# Altium schematic sheet WX0.011.911DL.SchDoc
size A3; Date: 2023/9/20; DocumentNumber: WX0.008.789DL
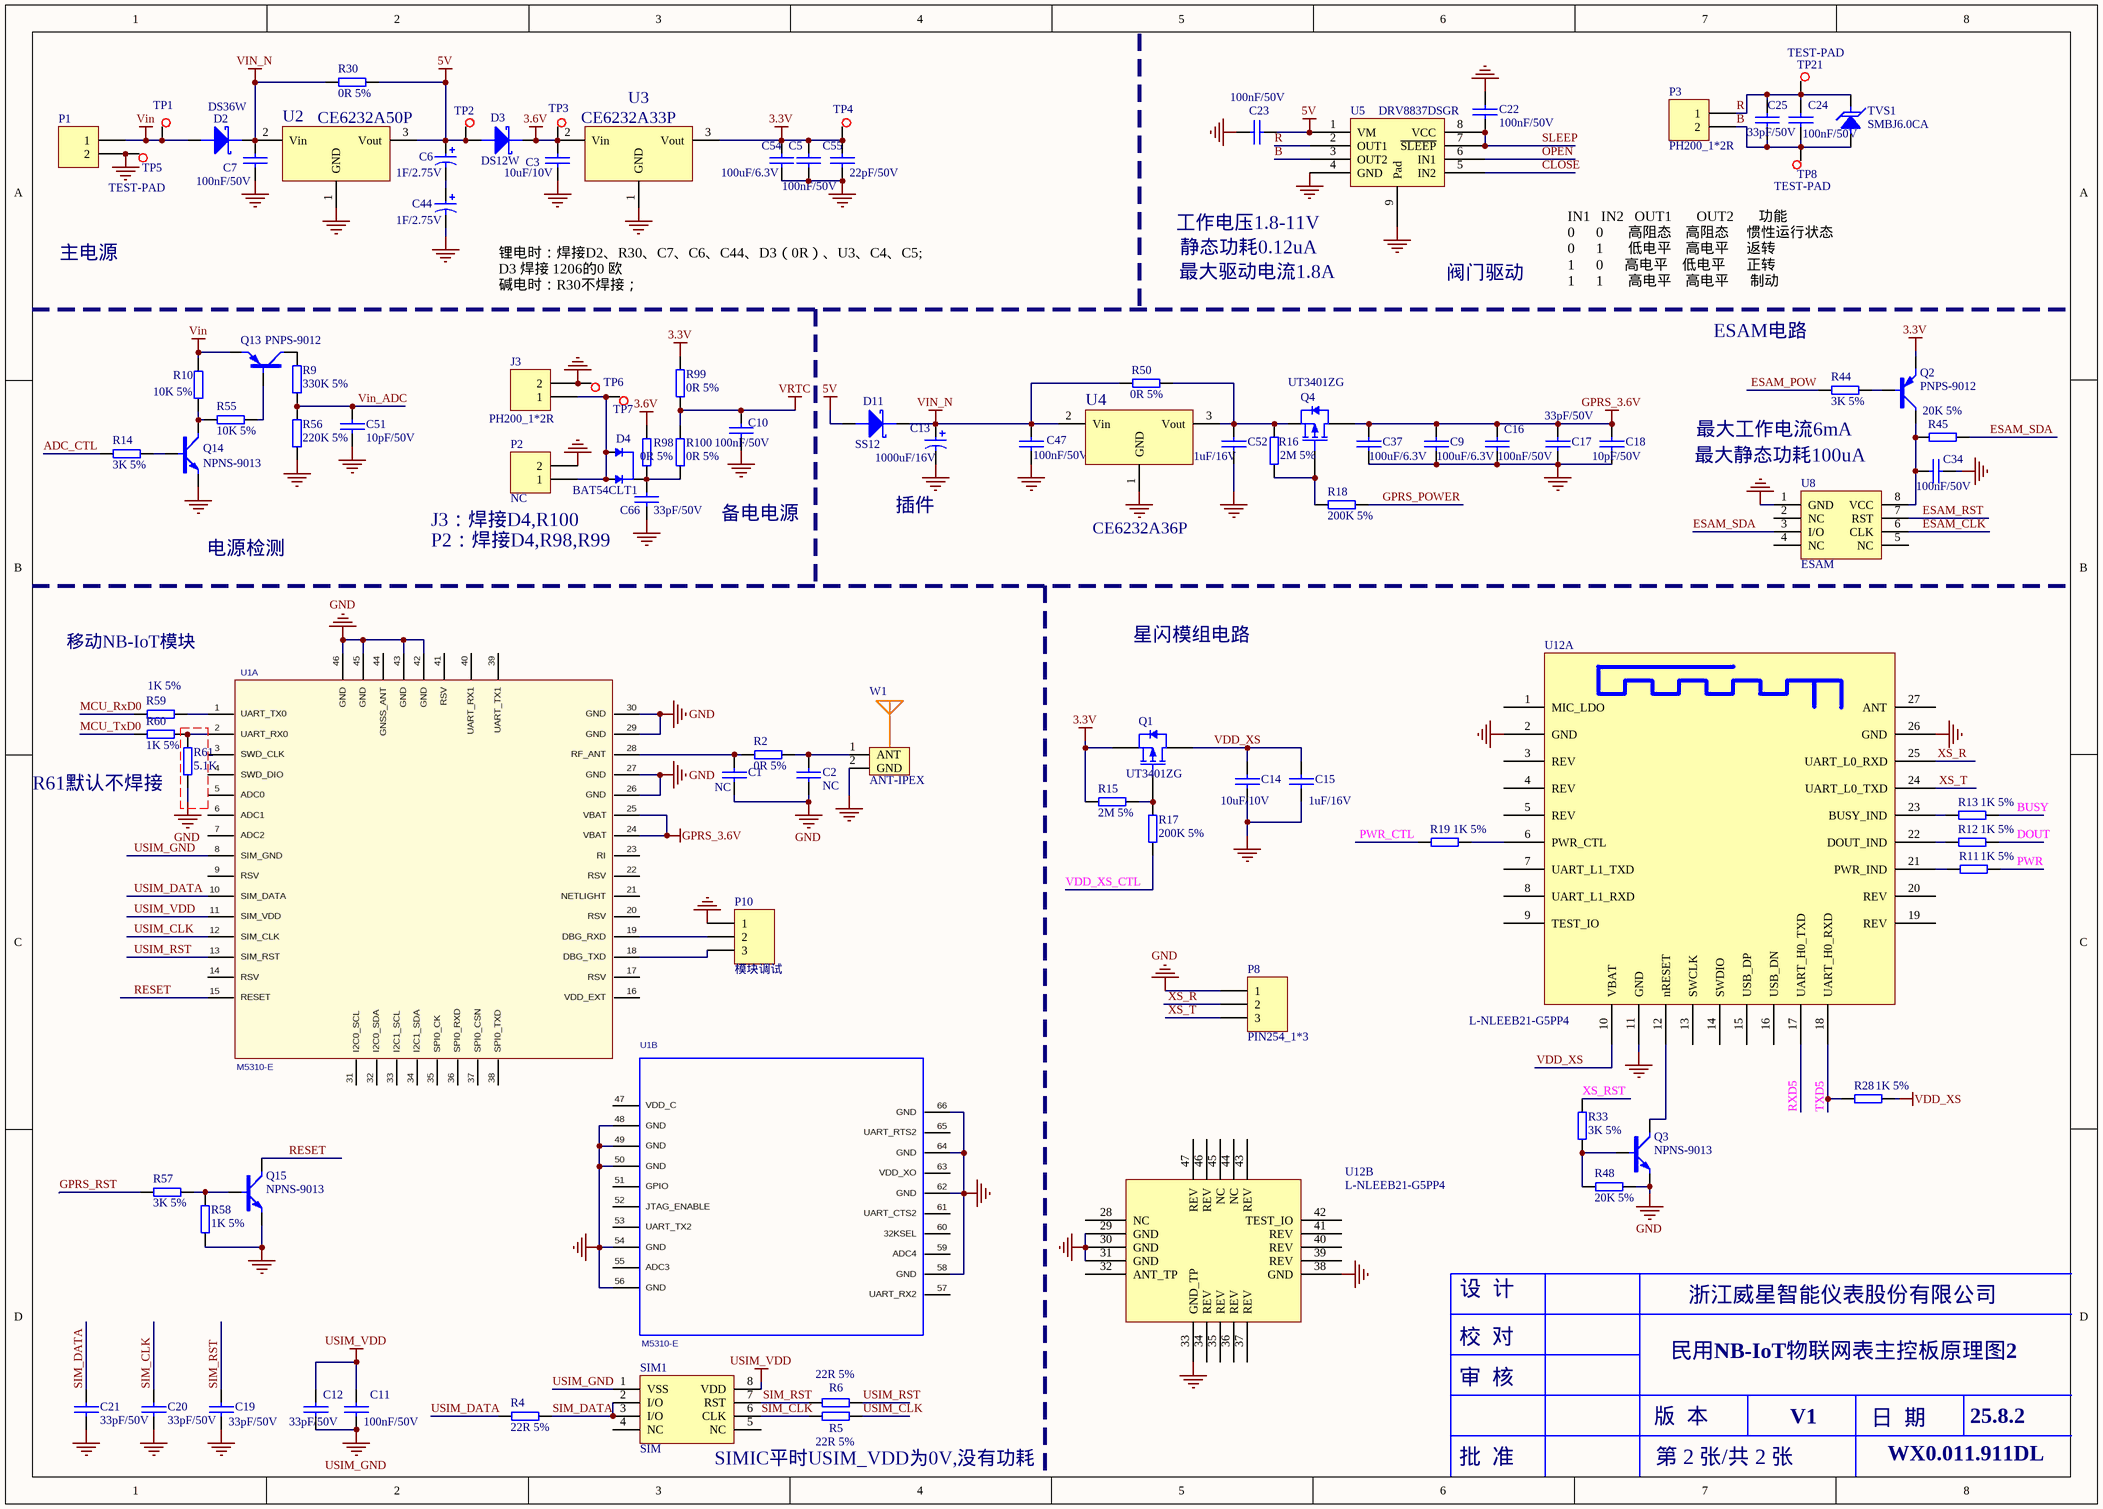
[diagram p0: WX0.011.911DL.SchDoc]

## Parts
C1  NC  [CAP0603]
C2  NC  [CAP0603]
C3  10uF/10V  [CAP0603]
C5  100nF/50V  [CAP0603]
C6  1F/2.75V  [CAPPC_350_800_1600R]
C7  100nF/50V  [CAP0603]
C9  100uF/6.3V  [GRM1206]
C10  100nF/50V  [CAP0603]
C11  100nF/50V  [CAP0603]
C12  33pF/50V  [CAP0603]
C13  1000uF/16V  [CAPPC_500_800_2000R]
C14  10uF/10V  [CAP0603]
C15  1uF/16V  [CAP0603]
C16  100nF/50V  [CAP0603]
C17  33pF/50V  [CAP0603]
C18  10pF/50V  [CAP0603]
C19  33pF/50V  [CAP0603]
C20  33pF/50V  [CAP0603]
C21  33pF/50V  [CAP0603]
C22  100nF/50V  [CAP0603]
C23  100nF/50V  [CAP0603]
C24  100nF/50V  [CAP0603]
C25  33pF/50V  [CAP0603]
C34  100nF/50V  [CAP0603]
C37  100uF/6.3V  [GRM1206]
C44  1F/2.75V  [CAPPC_350_800_1600R]
C47  100nF/50V  [CAP0603]
C51  10pF/50V  [CAP0603]
C52  1uF/16V  [CAP0603]
C54  100uF/6.3V  [GRM1206]
C55  22pF/50V  [CAP0603]
C66  33pF/50V  [CAP0603]
D2  DS36W  [SOD-123FL]
D3  DS12W  [SOD-123FL]
D4  BAT54CLT1  [SOT-23]
D11  SS12  [DO-214AC]
J3  PH200_1*2R
P1  (no value)  [PH200_1*2R_BAT]
P2  NC  [PH200_1*2R_BAT]
P3  PH200_1*2R  [PH200_1*2R]
P8  PIN254_1*3  [PIN254_1*3*WXHJ]
P10  模块调试  [PIN254_1*3*WXHJ]
Q1  UT3401ZG  [SOT-23]
Q2  PNPS-9012  [SOT-23]
Q3  NPNS-9013  [SOT-23]
Q4  UT3401ZG  [SOT-23]
Q13  PNPS-9012  [SOT-23]
Q14  NPNS-9013  [SOT-23]
Q15  NPNS-9013  [SOT-23]
R2  0R 5%  [RES0603]
R4  22R 5%  [RES0603]
R5  22R 5%  [RES0603]
R6  22R 5%  [RES0603]
R9  330K 5%  [RES0603]
R10  10K 5%  [RES0603]
R11  1K 5%  [RES0603]
R12  1K 5%  [RES0603]
R13  1K 5%  [RES0603]
R14  3K 5%  [RES0603]
R15  2M 5%  [RES0603]
R16  2M 5%  [RES0603]
R17  200K 5%  [RES0603]
R18  200K 5%  [RES0603]
R19  1K 5%  [RES0603]
R28  1K 5%  [RES0603]
R30  0R 5%  [RES1206]
R33  3K 5%  [RES0603]
R44  3K 5%  [RES0603]
R45  20K 5%  [RES0603]
R48  20K 5%  [RES0603]
R50  0R 5%  [RES1206]
R55  10K 5%  [RES0603]
R56  220K 5%  [RES0603]
R57  3K 5%  [RES0603]
R58  1K 5%  [RES0603]
R59  1K 5%  [RES0603]
R60  1K 5%  [RES0603]
R61  5.1K  [RES0603]
R98  0R 5%  [RES0603]
R99  0R 5%  [RES0603]
R100  0R 5%  [RES0603]
SIM1  SIM  [SIMIC]
TP1  TEST-PAD  [TEST-PAD]  (value not drawn)
TP2  TEST-PAD  [TEST-PAD]  (value not drawn)
TP3  TEST-PAD  [TEST-PAD]  (value not drawn)
TP4  TEST-PAD  [TEST-PAD]  (value not drawn)
TP5  TEST-PAD  [TEST-PAD]
TP6  TEST-PAD  [TEST-PAD]  (value not drawn)
TP7  TEST-PAD  [TEST-PAD]  (value not drawn)
TP8  TEST-PAD  [TEST-PAD]
TP21  TEST-PAD  [TEST-PAD]
TVS1  SMBJ6.0CA  [DO-214AA]
U1  M5310-E  [MOD_M5310EV]  (parts A,B of 2)
U2  CE6232A50P  [SOT-89]
U3  CE6232A33P  [SOT-89]
U4  CE6232A36P  [SOT-89]
U5  DRV8837DSGR  [S-PWSON-N8]
U8  ESAM
U12  L-NLEEB21-G5PP4  [L-NLEEB21-G5BP4]  (parts A,B of 2)
W1  ANT-IPEX  [ANT-IPEX]

## Nets
3.3V: C5.1 C54.2 C55.1 Q1.2(S) Q2.2(E) R15.1 R99.2 TP4.1 U3.3(Vout)
3.6V: C3.1 D3.2 R98.2 TP3.1 U3.2(Vin)
5V: C6.1 C23.2 D3.1 D11.1 R30.2 TP2.1 U2.3(Vout) U5.1(VM)
GND: C1.1 C2.1 C3.2 C5.2 C7.2 C9.2 C10.2 C13.2 C14.2 C15.2 C16.2 C17.2 C18.1 C19.2 C20.2 C21.2 C22.1 C23.1 C34.2 C37.2 C44.2 C47.2 C51.1 C52.2 C54.1 C55.2 C66.2 J3.2 P1.2 P2.2 P8.1 P10.1 Q3.2(E) Q14.2(E) Q15.2(E) R48.2 R56.2 R58.1 R61.2 TP5.1 TP6.1 U1.26(GND) U1.27(GND) U1.29(GND) U1.30(GND) U1.42(GND) U1.43(GND) U1.45(GND) U1.46(GND) U1.48(GND) U1.49(GND) U1.50(GND) U1.54(GND) U1.56(GND) U1.58(GND) U1.62(GND) U1.64(GND) U1.66(GND) U2.1(GND) U3.1(GND) U4.1(GND) U5.4(GND) U5.9(Pad) U8.1(GND) U12.2(GND) U12.11(GND) U12.26(GND) U12.29(GND) U12.30(GND) U12.31(GND) U12.33(GND_TP) U12.38(GND) W1.2(GND)
GPRS_3.6V: C9.1 C16.1 C17.1 C18.2 C37.1 Q4.3(D) U1.24(VBAT) U1.25(VBAT)
USIM_GND: C11.2 C12.2 SIM1.1(VSS) U1.8(SIM_GND)
USIM_VDD: C11.1 C12.1 SIM1.8(VDD) U1.11(SIM_VDD)
VDD_XS: C14.1 C15.1 Q1.3(D) R28.1 U12.10(VBAT)
Vin: D2.1 P1.1 Q13.2(E) R10.2 TP1.1
VIN_N: C7.1 C13.1 C47.1 D2.2 D11.2 R30.1 R50.1 U2.2(Vin) U4.2(Vin)
VRTC: C10.1 R99.1 R100.2
ADC_CTL: R14.1
B: C24.2 C25.2 P3.2 TP8.1 TVS1.1 U5.3(OUT2)
BUSY: R13.1
CLOSE: U5.5(IN2)
DOUT: R12.1
ESAM_CLK: U8.6(CLK)
ESAM_POW: R44.1
ESAM_RST: U8.7(RST)
ESAM_SDA: R45.2 U8.3(I/O)
GPRS_POWER: R18.1
GPRS_RST: R57.1
MCU_RxD0: R59.1
MCU_TxD0: R60.1
OPEN: U5.6(IN1)
PWR: R11.1
PWR_CTL: R19.2
R: C24.1 C25.1 P3.1 TP21.1 TVS1.2 U5.2(OUT1)
RESET: Q15.3(C) U1.15(RESET)
RXD5: U12.17(UART_H0_TXD)
SIM_CLK: C20.1 R5.1 SIM1.6(CLK)
SIM_DATA: C21.1 R4.2 SIM1.2(I/O) SIM1.3(I/O)
SIM_RST: C19.1 R6.1 SIM1.7(RST)
SLEEP: C22.2 U5.7(~{SLEEP}) U5.8(VCC)
TXD5: R28.2 U12.18(UART_H0_RXD)
USIM_CLK: R5.2 U1.12(SIM_CLK)
USIM_DATA: R4.1 U1.10(SIM_DATA)
USIM_RST: R6.2 U1.13(SIM_RST)
VDD_XS_CTL: R17.1
Vin_ADC: C51.2 R9.2 R56.1
XS_R: P8.2 U12.25(UART_L0_RXD)
XS_RST: R33.1
XS_T: P8.3 U12.24(UART_L0_TXD)
NetC1_2: C1.2 R2.2 U1.28(RF_ANT)
NetC2_2: C2.2 R2.1 W1.1(ANT)
NetC6_2: C6.2 C44.1
NetC34_1: C34.1 Q2.3(C) R45.1 U8.8(VCC)
NetC52_1: C52.1 Q4.2(S) R16.2 R50.2 U4.3(Vout)
NetC66_1: C66.1 D4.3(C) R98.1 R100.1
NetD4_1: D4.1(A) D4.2(A) J3.1 P2.1 TP7.1
NetP10_2: P10.2 U1.19(DBG_RXD)
NetP10_3: P10.3 U1.18(DBG_TXD)
NetQ1_1: Q1.1(G) R15.2 R17.2
NetQ2_1: Q2.1(B) R44.2
NetQ3_1: Q3.1(B) R33.2 R48.1
NetQ3_3: Q3.3(C) U12.12(nRESET)
NetQ4_1: Q4.1(G) R16.1 R18.2
NetQ13_1: Q13.1(B) R55.2
NetQ13_3: Q13.3(C) R9.1
NetQ14_1: Q14.1(B) R14.2
NetQ14_3: Q14.3(C) R10.1 R55.1
NetQ15_1: Q15.1(B) R57.2 R58.2
NetR11_2: R11.2 U12.21(PWR_IND)
NetR12_2: R12.2 U12.22(DOUT_IND)
NetR13_2: R13.2 U12.23(BUSY_IND)
NetR19_1: R19.1 U12.6(PWR_CTL)
NetR59_2: R59.2 U1.1(UART_TX0)
NetR60_2: R60.2 R61.1 U1.2(UART_RX0)

Not connected (* = marked no-connect by the designer): SIM1 4(NC) 5(NC); U1 3(SWD_CLK) 4(SWD_DIO) 5(ADC0) 6(ADC1) 7(ADC2) 9(RSV) 14(RSV) 16(VDD_EXT) 17(RSV) 20(RSV) 21(NETLIGHT) 22(RSV) 23(RI) 31(I2C0_SCL) 32(I2C0_SDA) 33(I2C1_SCL) 34(I2C1_SDA) 35(SPI0_CK) 36(SPI0_RXD) 37(SPI0_CSN) 38(SPI0_TXD) 39(UART_TX1) 40(UART_RX1) 41(RSV) 44(GNSS_ANT) 47(VDD_C) 51(GPIO) 52(JTAG_ENABLE) 53(UART_TX2) 55(ADC3) 57(UART_RX2) 59(ADC4) 60(32KSEL) 61(UART_CTS2) 63(VDD_XO) 65(UART_RTS2); U8 2(NC) 4(NC) 5(NC); U12 1(MIC_LDO) 3(REV) 4(REV) 5(REV) 7(UART_L1_TXD) 8(UART_L1_RXD) 9(TEST_IO) 13(SWCLK) 14(SWDIO) 15(USB_DP) 16(USB_DN) 19(REV) 20(REV) 27(ANT) 28(NC) 32(ANT_TP) 34(REV) 35(REV) 36(REV) 37(REV) 39(REV) 40(REV) 41(REV) 42(TEST_IO) 43(REV) 44(NC) 45(NC) 46(REV) 47(REV)

## Notes on the sheet
- 工作电压1.8-11V
- 主电源
- 锂电时：焊接D2、R30、C7、C6、C44、D3（0R）、U3、C4、C5; D3 焊接 1206的0 欧
  碱电时：R30不焊接；
- 最大驱动电流1.8A
- 静态功耗0.12uA
- 阀门驱动
- IN1   IN2   OUT1       OUT2       功能
  0      0       高阻态    高阻态     惯性运行状态
  0      1       低电平    高电平     返转
  1      0      高电平    低电平      正转
  1      1       高电平    高电平      制动
- ESAM电路
- 最大工作电流6mA
- 插件
- (near U8) 最大静态功耗100uA
- 电源检测
- P2：焊接D4,R98,R99
- (near P2) J3：焊接D4,R100
- 备电电源
- 移动NB-IoT模块
- 星闪模组电路
- R61默认不焊接
- 设  计
- 浙江威星智能仪表股份有限公司
- 审  核
- 校  对
- 民用NB-IoT物联网表主控板原理图2
- 版  本
- V1
- 日  期
- WX0.011.911DL
- 25.8.2
- SIMIC平时USIM_VDD为0V,没有功耗
- 批  准
- 第 2 张/共 2 张
- 设   计
- 校   对
- 邓琴琴
- 冯翰
- 审   核
- 标准化
- 版本
- 日期
- 批   准
- 刘晓峰
- 第       张  /  共       张

## Library data of the parts
C1 C2 = 101020103-0005: 12P,50 V,±5%,0603,国巨,CC0603JRNPO9BN12; Part Name: 0603贴片电容; ID: 11; SMD/DIP: SMD; Part Number: 101020103-0005
C3 C14 = 101020103-0026: 106pF,10 V,±10%,0603,村田,GRM188R61A106KE47D; Part Name: 0603贴片电容; ID: 8; SMD/DIP: SMD; Part Number: 101020103-0026
C5 C7 C10 C11 C16 C22-C24 C34 C47 = 101020103-0021: 104pF,50 V,±10%,0603,国巨,CC0603KRX7R9BB104; Part Name: 0603贴片电容; ID: 3; SMD/DIP: SMD; Part Number: 101020103-0021
C6 C44 = 1010202-0015: 1F,2.75 V,-20%~+20%,8mm*16mm,红宝石,2.7 DMC 1 M MY4 8X16; Part Name: 法拉电容; ID: 12; SMD/DIP: DIP; Part Number: 1010202-0015
C9 C37 C54 = 101020101-0020: 100uF,6.3 V,±20%,1206,村田,GRM31CR60J107ME39L; Part Name: 贴片电容; ID: 27; SMD/DIP: SMD; Part Number: 101020101-0020
C12 C17 C19-C21 C25 C66 = 101020103-0027: 33pF,50 V,±10%,0603,国巨,CC0603KRNPO9BN33; Part Name: 0603贴片电容; ID: 18; SMD/DIP: SMD; Part Number: 101020103-0027
C13 = 1010203-0029: 1000uF,16 V,±20%,8*20mm,Rubycon,16ZLH1000M; Part Name: 电解电容; ID: 2; SMD/DIP: DIP; Part Number: 1010203-0029
C15 C52 = 101020103-0003: 105pF,16 V,±10%,0603,国巨,CC0603KRX7R7BB105; Part Name: 0603贴片电容; ID: 14; SMD/DIP: SMD; Part Number: 101020103-0003
C18 C51 = 101020103-0014: 10pF,50 V,±5%,0603,X7R,国巨,CC0603JRNPO9BN100; Part Name: 0603贴片电容; ID: 7; SMD/DIP: SMD; Part Number: 101020103-0014
C55 = 101020103-0009: 22pF,50 V,±5%,0603,国巨,CC0603JRNPO9BN22; Part Name: 0603贴片电容; ID: 16; SMD/DIP: SMD; Part Number: 101020103-0009
D2 = 101040101-0048: DS36W,SOD123-FL,3 A,42 V,60 V,浙江领晨科技有限公司,DS36W; Part Number: 101040101-0055; Part Name: 贴片肖特基; ID: 8; SMD/DIP: SMD
D3 = 101040101-0048: DS12W,SOD-123FL,1 A,0.55 V,20 V,领晨科技,DS12W; Part Name: 贴片肖特基; ID: 9; SMD/DIP: SMD; Part Number: 101040101-0048
D4 = 101040101-0038: BAT54CLT1，SOT23-3,SOT23-3,0.2 A,0.8 V,30 V,安森美,BAT54CLT1; Part Name: 贴片肖特基; ID: 31; SMD/DIP: SMD; Part Number: 101040101-0038
D11 = 101040101-0009: SS12,DO-214AC,1 A,0.55 V,20 V,昶鑫,SS12; Part Name: 贴片肖特基; ID: 13; SMD/DIP: SMD; Part Number: 101040101-0009
J3 P1-P3 = 1010902-0105: 2.0-2AW,直插弯座，2PIN，脚间距2mm，带防翘起,公头,单排,2.0-2AW;直插弯座，2PIN,脚间距2mm，带防翘起; Part Name: PH座; ID: 11; SMD/DIP: DIP; Part Number: 1010902-0105
P10 = AD_WXHJ_PinHeader_04: 1*3 ，Φ1.0 ，2.54mm，直脚,无需焊接器件; Part Name: 排针; ID: 27; SMD/DIP: DIP; Part Number: AD_WXHJ_PinHeader_04
Q1 Q4 = 101040201-0013: UT3401ZG,P-MOS,SOT-23,UTC,UT3401ZG; Part Name: 功率MOS管; ID: 18; SMD/DIP: SMD; Part Number: 101040201-0013
Q2 = 101040201-0001: 9012,PNP,SOT-23,JCET;长电,S9012; Part Name: 贴片三极管; ID: 16; SMD/DIP: SMD; Part Number: 101040201-0001
Q3 Q14 = 101040201-0002: 9013,NPN,SOT-23,长电,S9013; Part Name: 贴片三极管; ID: 15; SMD/DIP: SMD; Part Number: 101040201-0002
Q13 = 101040201-0001: 9012,PNP,SOT-23,JCET;长电,S9012; Part Name: 贴片三极管; ID: 17; SMD/DIP: SMD; Part Number: 101040201-0001
Q15 = 101040201-0002: 9013,NPN,SOT-23,长电,S9013; Part Name: 贴片三极管; ID: 14; SMD/DIP: SMD; Part Number: 101040201-0002
R2 = 101010103-0001: 国巨,±5%,0603,,155 ℃,-55 ℃,RC0603J2-070RL,无铅,200 ppm/℃,1/10W,,0R; Part Name: 0603贴片电阻; ID: 1; SMD/DIP: SMD; Part Number: 101010103-0001
R4-R6 = 101010103-0009: 国巨,±5%,0603,,155 ℃,-55 ℃,RC0603JR-0722RL,无铅,200 ppm/℃,1/10W,,22欧; Part Name: 0603贴片电阻; ID: 17; SMD/DIP: SMD; Part Number: 101010103-0009
R9 = 101010103-0066: 330K,±5%,1/10W,0603,国巨,RC0603JR-07330KL; Part Name: 0603贴片电阻; ID: 31; SMD/DIP: SMD; Part Number: 101010103-0066
R10 R44 R55 = 101010103-0003: 国巨,±5%,0603,,155 ℃,-55 ℃,RC0603JR-0710KL,无铅,200 ppm/℃,1/10W,,10K; Part Name: 0603贴片电阻; ID: 7; SMD/DIP: SMD; Part Number: 101010103-0003
R11-R13 R19 R28 R58 = 101010103-0008: 1K,±5%,1/10W,0603,国巨,RC0603JR-071KL; Part Name: 0603贴片电阻; ID: 10; SMD/DIP: SMD; Part Number: 101010103-0008
R14 R33 = 101010103-0006: 国巨,±5%,0603,,155 ℃,-55 ℃,RC0603JR-073KL,无铅,100 ppm/℃,1/10W,,3K; Part Name: 0603贴片电阻; ID: 23; SMD/DIP: SMD; Part Number: 101010103-0006
R15 R17 = 101010103-0003: 10K±5%,1/10W,0603; Part Name: 0603贴片电阻; ID: 32; Part Number: 101010103-0003
R16 = 101010103-0025: 国巨,±5%,0603,,155 ℃,-55 ℃,RC0603JR-072ML,含铅,100 ppm/℃,1/10W,,2M; Part Name: 0603贴片电阻; ID: 20; SMD/DIP: SMD; Part Number: 101010103-0025
R18 = 101010103-0034: 200K,±5%,1/10W,0603,国巨,RC0603JR-07200KL; Part Name: 0603贴片电阻; ID: 13; SMD/DIP: SMD; Part Number: 101010103-0034
R30 R50 R98-R100 = 101010101-0013: 0Ω,±5%,1/4W,1206,国巨,RC1206JR-070RL; Part Name: 1206贴片电阻; ID: 2; SMD/DIP: SMD; Part Number: 101010101-0013
R45 R48 R60 R61 = 101010103-0004: 国巨,±5%,0603,,155 ℃,-55 ℃,RC0603JR-0720KL,无铅,200 ppm/℃,1/10W,,20K; Part Name: 0603贴片电阻; ID: 15; SMD/DIP: SMD; Part Number: 101010103-0004
R56 = 101010103-0044: 220K,±5%,1/10W,0603,国巨,RC0603JR-07220KL; Part Name: 0603贴片电阻; ID: 30; SMD/DIP: SMD; Part Number: 101010103-0044
R57 = 101010103-0006: 国巨,±5%,0603,,155 ℃,-55 ℃,RC0603JR-073KL,无铅,100 ppm/℃,1/10W,,3K; Part Name: 0603贴片电阻; ID: 22; SMD/DIP: SMD; Part Number: 101010103-0006
R59 = 101010103-0008: 1K,±5%,1/10W,0603,国巨,RC0603JR-071KL; Part Name: 0603贴片电阻; ID: 9; SMD/DIP: SMD; Part Number: 101010103-0008
SIM1 = 05_SIMIC
TP1-TP8 TP21 = AD_WXHJ_TEST-PAD_01: 单面焊盘测试点; Part Name: 测试点; ID: 23; SMD/DIP: SMD; Part Number: AD_WXHJ_TEST-PAD_01
TVS1 = 101040101-0024: SMBJ6.0CA,DO-214AA,10.3 V,6.0 V,600 W,58.3 A,800 uA,上海君耀电子有限公司,SMBJ6.0CA; Part Name: TVS管; ID: 23; SMD/DIP: SMD; Part Number: 101040101-0024
U1 = MOD_M5310EV_LGA66P: Module_M5310EV_0.9mm; Vendor: 中移物联网; Geometry.Height: 0.9mm; Value: Module_M5310EV; Manufacturer: Module_M5310EV; PCB DECAL: MOD_M5310EV
U2 = 1010503-0013: S-1206B50-U3,S-1206B50-U3,SOT89-3,6.5 V,1.7 V,0.2 V,5 V,250mA@VIN≧VOUT(S)＋1.0 V﹐1.5 V≦VOUT(S),1 uA,精工电子; Part Name: 贴片稳压器; ID: 6; SMD/DIP: SMD; Part Number: 1010503-0013
U3 = 1010503-0002: S-1206B33-U3T1G,S-1206B33-U3T1G,SOT89-3,6.5 V,1.7 V,0.15 V,3.3 V,250mA@VIN≧VOUT(S)＋1.0 V﹐1.5 V≦VOUT(S),1 uA,精工电子; Part Name: 线性稳压芯片; ID: 5; SMD/DIP: SMD; Part Number: 1010503-0002
U4 = 1010503-0031: CE6232A36P,CE6232A36P,SOT89-3,8 V,1.8 V,0.11 V,3.6 V,600mA,0.8 uA,南京芯力微电子有限公司; Part Name: 贴片稳压器; ID: 30; SMD/DIP: SMD; Part Number: 1010503-0031
U5 = 101050101-0060: DRV8837DSGR,S-PWSON-N8,TI,DRV8837DSGR; Part Name: 驱动芯片; ID: 23; SMD/DIP: SMD; Part Number: 101050101-0060
U8 = 04_ESAM
U12 = L-NLEEB21-G5BP4
W1 = 1010902-0053: IPEX，配GPRS天线转接线; Part Name: IPEX座; ID: 2; SMD/DIP: DIP; Part Number: 1010902-0053